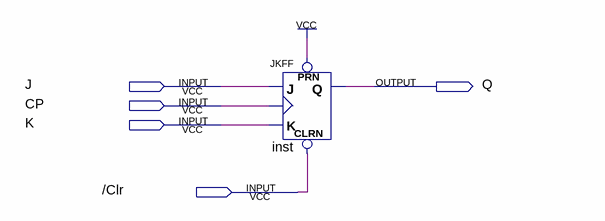
[diagram p0: schematic sheet]
// Quartus schematic JK_FlipFlop_jkff.bdf as structural Verilog: 1 symbols, 5 pins
module JK_FlipFlop_jkff (
  input  J,
  input  CP,
  input  K,
  input  \/Clr ,
  output Q
);

  JKFF inst (.PRN(1'b1), .CLRN(\/Clr ), .K(K), .J(J), .CLK(CP), .Q(Q));
endmodule
